# EAGLE schematic wordclock-r2-grid-routed (EAGLE 5.11)
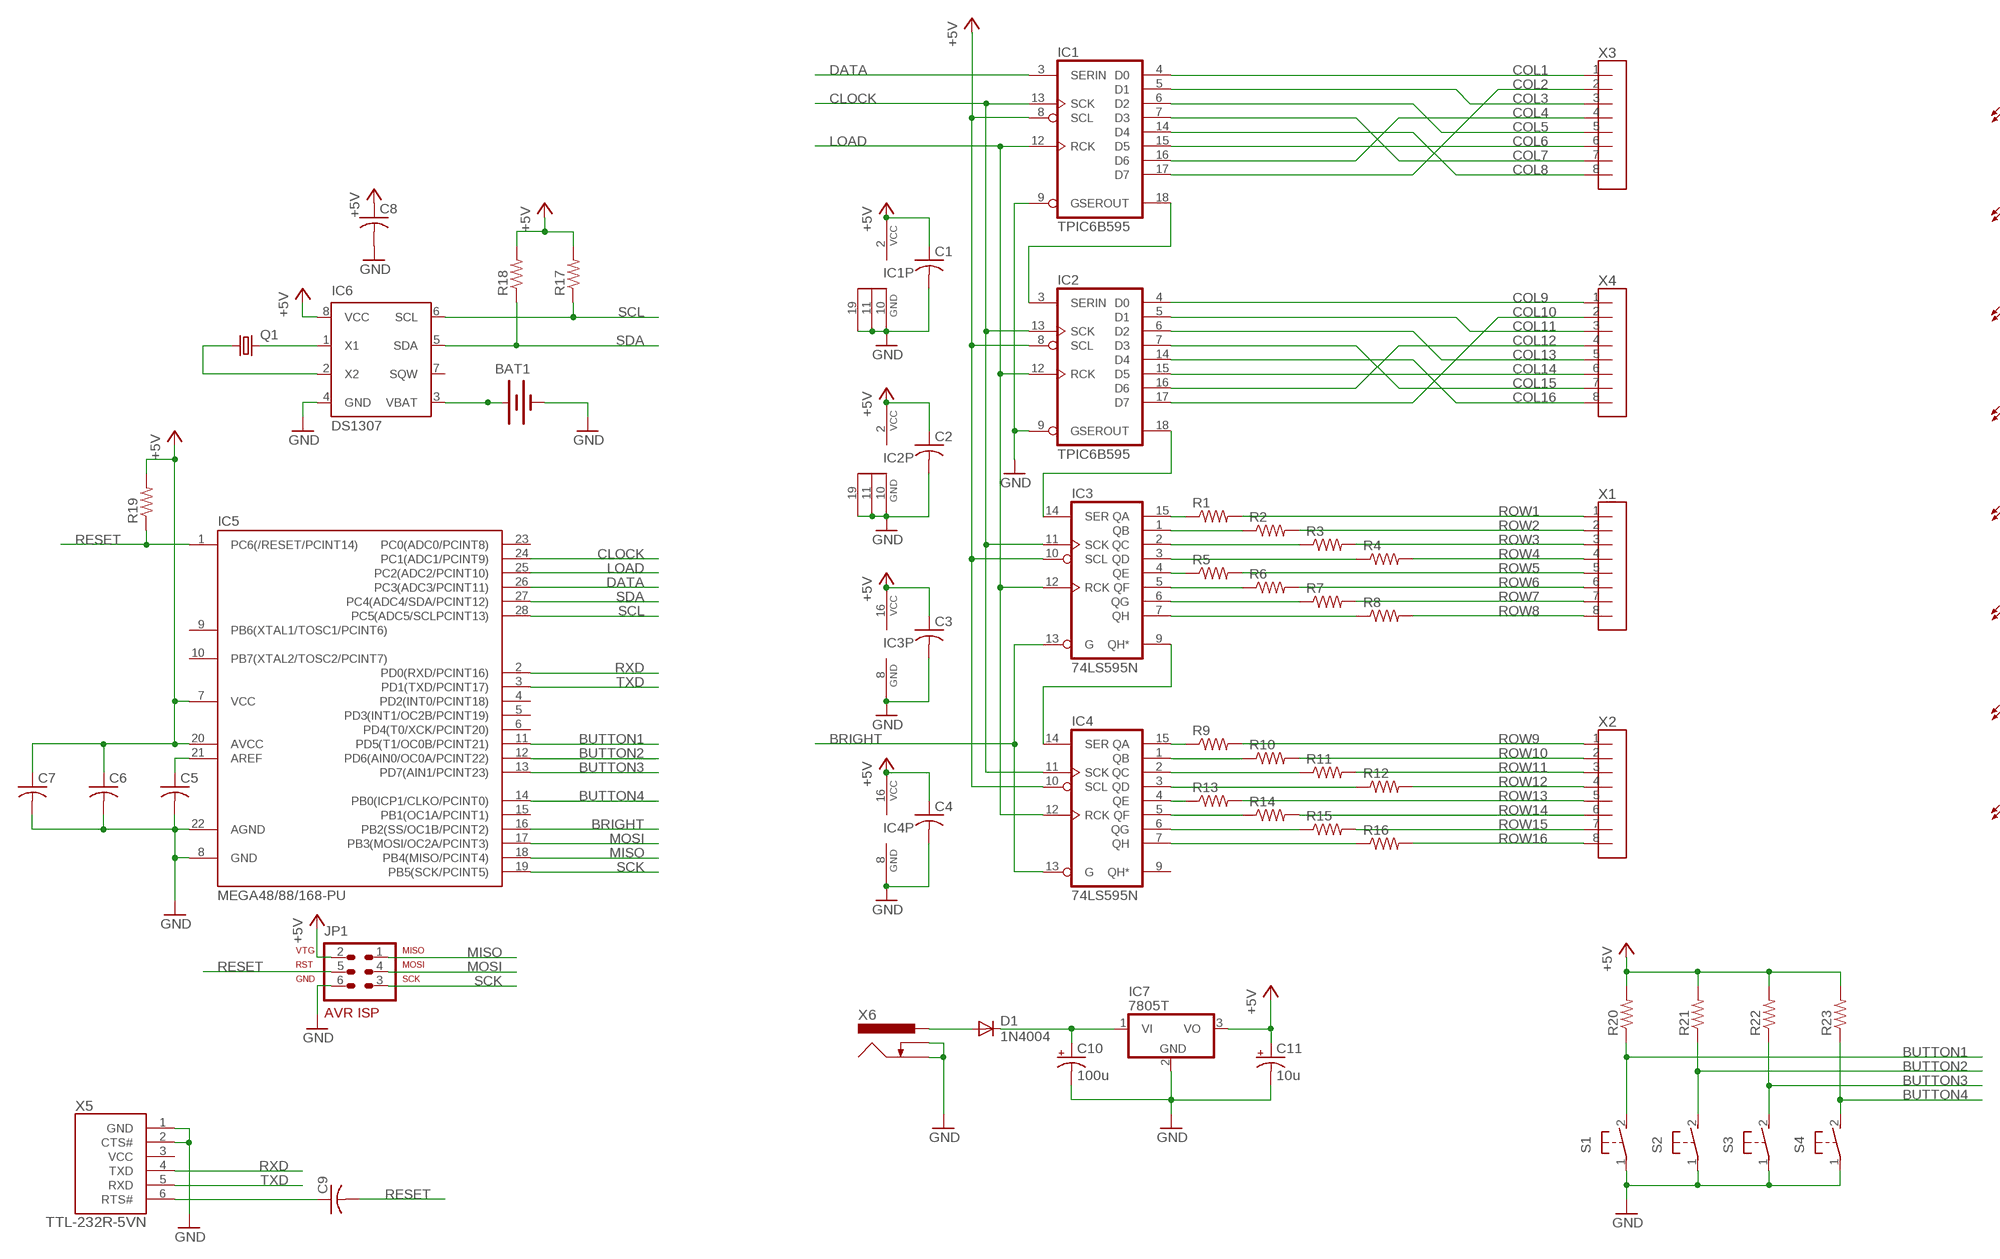
[diagram p0: schematic, sheet 1, part 1 of 2]
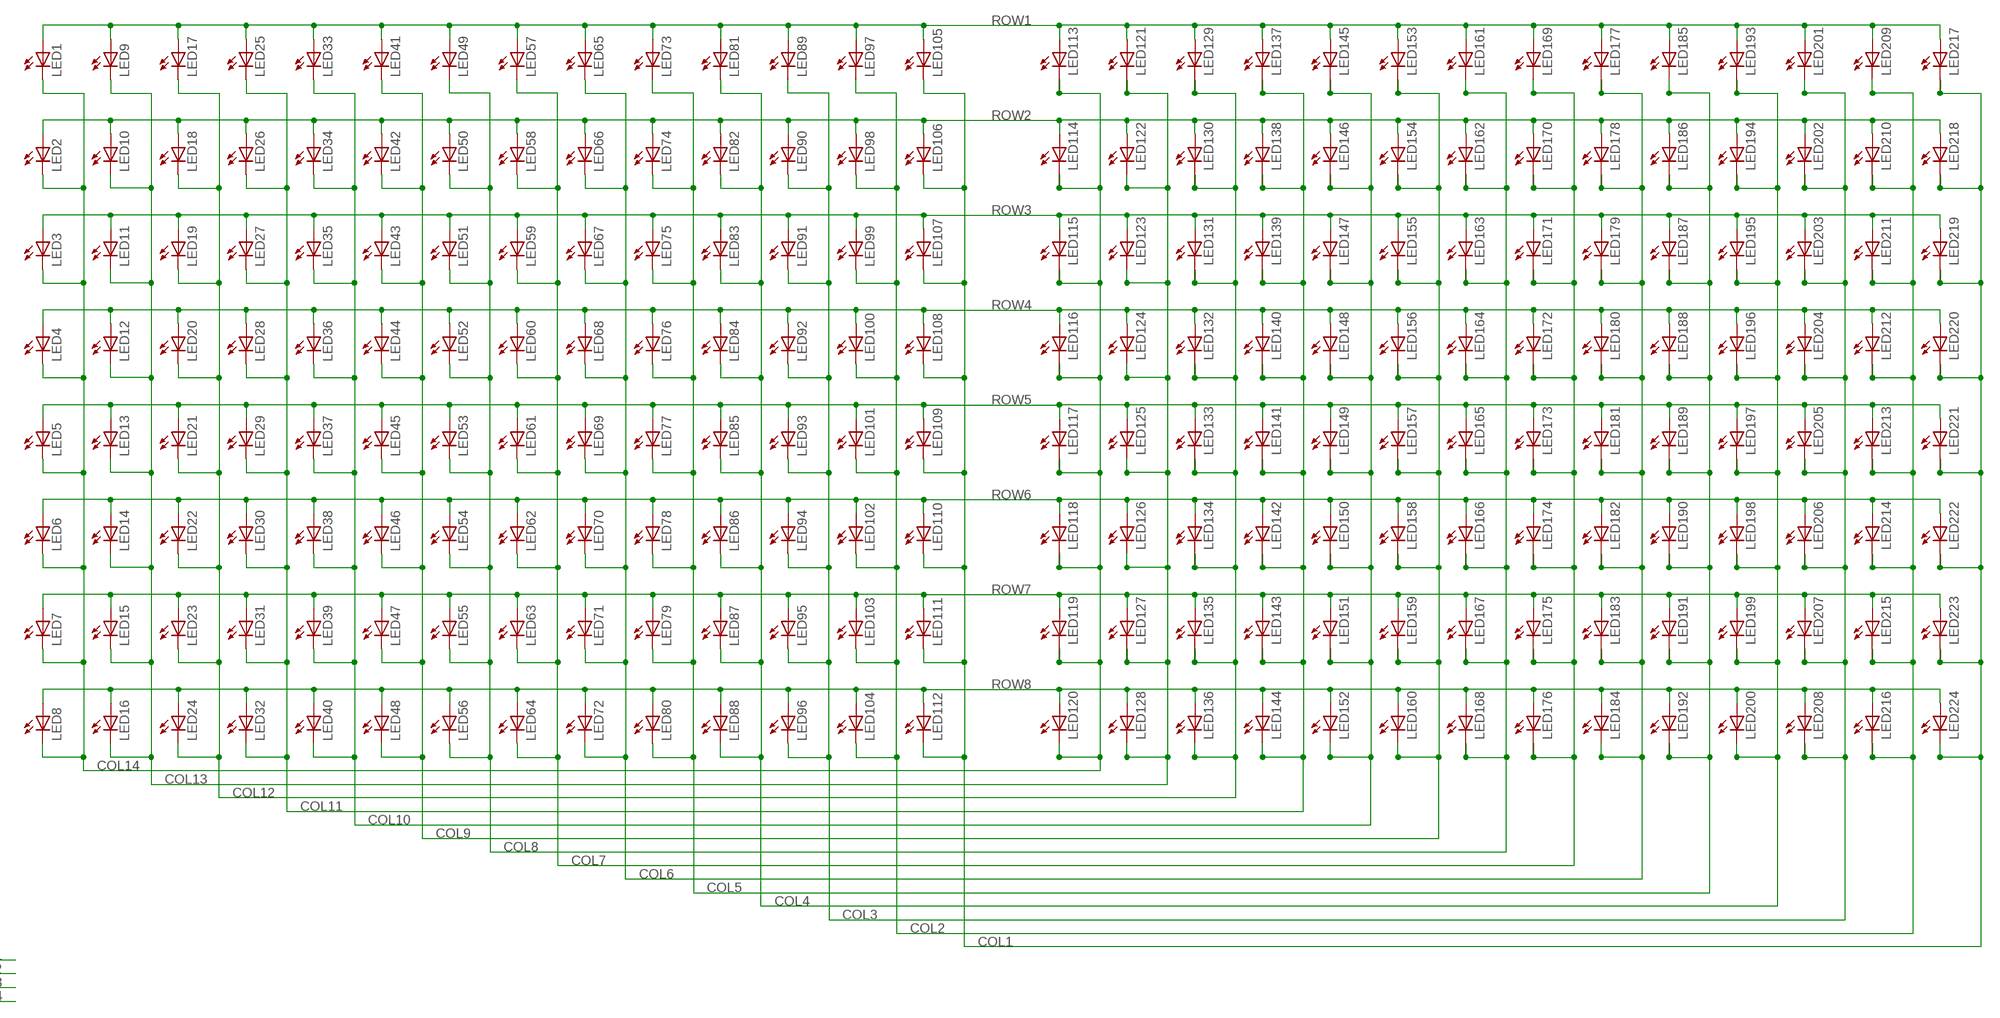
[diagram p1: schematic, sheet 1, part 2 of 2]

## Parts
BAT1  BATTERY12MM  [BATTCON_12MM]
C1  C-US050-025X075  [C050-025X075]
C2  C-US050-025X075  [C050-025X075]
C3  C-US050-025X075  [C050-025X075]
C4  C-US050-025X075  [C050-025X075]
C5  C-US050-025X075  [C050-025X075]
C6  C-US050-025X075  [C050-025X075]
C7  C-US050-025X075  [C050-025X075]
C8  C-US050-025X075  [C050-025X075]
C9  C-US050-025X075  [C050-025X075]
C10  100u  CPOL-USE3.5-8  [E3,5-8]
C11  10u  CPOL-USE2.5-6  [E2,5-6]
D1  1N4004  [DO41-10]
IC1  TPIC6B595  [DIL20]
IC2  TPIC6B595  [DIL20]
IC3  74LS595N  [DIL16]
IC4  74LS595N  [DIL16]
IC5  MEGA48/88/168-PU  [DIL28-3]
IC6  DS1307  [DIL08]
IC7  7805T  [TO220H]
JP1  AVR-ISP-6  [AVR-ISP-6]
LED1  LEDKA-3528ASYC  [KA-3528ASYC]
LED2  LEDKA-3528ASYC  [KA-3528ASYC]
LED3  LEDKA-3528ASYC  [KA-3528ASYC]
LED4  LEDKA-3528ASYC  [KA-3528ASYC]
LED5  LEDKA-3528ASYC  [KA-3528ASYC]
LED6  LEDKA-3528ASYC  [KA-3528ASYC]
LED7  LEDKA-3528ASYC  [KA-3528ASYC]
LED8  LEDKA-3528ASYC  [KA-3528ASYC]
LED9  LEDKA-3528ASYC  [KA-3528ASYC]
LED10  LEDKA-3528ASYC  [KA-3528ASYC]
LED11  LEDKA-3528ASYC  [KA-3528ASYC]
LED12  LEDKA-3528ASYC  [KA-3528ASYC]
LED13  LEDKA-3528ASYC  [KA-3528ASYC]
LED14  LEDKA-3528ASYC  [KA-3528ASYC]
LED15  LEDKA-3528ASYC  [KA-3528ASYC]
LED16  LEDKA-3528ASYC  [KA-3528ASYC]
LED17  LEDKA-3528ASYC  [KA-3528ASYC]
LED18  LEDKA-3528ASYC  [KA-3528ASYC]
LED19  LEDKA-3528ASYC  [KA-3528ASYC]
LED20  LEDKA-3528ASYC  [KA-3528ASYC]
LED21  LEDKA-3528ASYC  [KA-3528ASYC]
LED22  LEDKA-3528ASYC  [KA-3528ASYC]
LED23  LEDKA-3528ASYC  [KA-3528ASYC]
LED24  LEDKA-3528ASYC  [KA-3528ASYC]
LED25  LEDKA-3528ASYC  [KA-3528ASYC]
LED26  LEDKA-3528ASYC  [KA-3528ASYC]
LED27  LEDKA-3528ASYC  [KA-3528ASYC]
LED28  LEDKA-3528ASYC  [KA-3528ASYC]
LED29  LEDKA-3528ASYC  [KA-3528ASYC]
LED30  LEDKA-3528ASYC  [KA-3528ASYC]
LED31  LEDKA-3528ASYC  [KA-3528ASYC]
LED32  LEDKA-3528ASYC  [KA-3528ASYC]
LED33  LEDKA-3528ASYC  [KA-3528ASYC]
LED34  LEDKA-3528ASYC  [KA-3528ASYC]
LED35  LEDKA-3528ASYC  [KA-3528ASYC]
LED36  LEDKA-3528ASYC  [KA-3528ASYC]
LED37  LEDKA-3528ASYC  [KA-3528ASYC]
LED38  LEDKA-3528ASYC  [KA-3528ASYC]
LED39  LEDKA-3528ASYC  [KA-3528ASYC]
LED40  LEDKA-3528ASYC  [KA-3528ASYC]
LED41  LEDKA-3528ASYC  [KA-3528ASYC]
LED42  LEDKA-3528ASYC  [KA-3528ASYC]
LED43  LEDKA-3528ASYC  [KA-3528ASYC]
LED44  LEDKA-3528ASYC  [KA-3528ASYC]
LED45  LEDKA-3528ASYC  [KA-3528ASYC]
LED46  LEDKA-3528ASYC  [KA-3528ASYC]
LED47  LEDKA-3528ASYC  [KA-3528ASYC]
LED48  LEDKA-3528ASYC  [KA-3528ASYC]
LED49  LEDKA-3528ASYC  [KA-3528ASYC]
LED50  LEDKA-3528ASYC  [KA-3528ASYC]
LED51  LEDKA-3528ASYC  [KA-3528ASYC]
LED52  LEDKA-3528ASYC  [KA-3528ASYC]
LED53  LEDKA-3528ASYC  [KA-3528ASYC]
LED54  LEDKA-3528ASYC  [KA-3528ASYC]
LED55  LEDKA-3528ASYC  [KA-3528ASYC]
LED56  LEDKA-3528ASYC  [KA-3528ASYC]
LED57  LEDKA-3528ASYC  [KA-3528ASYC]
LED58  LEDKA-3528ASYC  [KA-3528ASYC]
LED59  LEDKA-3528ASYC  [KA-3528ASYC]
LED60  LEDKA-3528ASYC  [KA-3528ASYC]
LED61  LEDKA-3528ASYC  [KA-3528ASYC]
LED62  LEDKA-3528ASYC  [KA-3528ASYC]
LED63  LEDKA-3528ASYC  [KA-3528ASYC]
LED64  LEDKA-3528ASYC  [KA-3528ASYC]
LED65  LEDKA-3528ASYC  [KA-3528ASYC]
LED66  LEDKA-3528ASYC  [KA-3528ASYC]
LED67  LEDKA-3528ASYC  [KA-3528ASYC]
LED68  LEDKA-3528ASYC  [KA-3528ASYC]
LED69  LEDKA-3528ASYC  [KA-3528ASYC]
LED70  LEDKA-3528ASYC  [KA-3528ASYC]
LED71  LEDKA-3528ASYC  [KA-3528ASYC]
LED72  LEDKA-3528ASYC  [KA-3528ASYC]
LED73  LEDKA-3528ASYC  [KA-3528ASYC]
LED74  LEDKA-3528ASYC  [KA-3528ASYC]
LED75  LEDKA-3528ASYC  [KA-3528ASYC]
LED76  LEDKA-3528ASYC  [KA-3528ASYC]
LED77  LEDKA-3528ASYC  [KA-3528ASYC]
LED78  LEDKA-3528ASYC  [KA-3528ASYC]
LED79  LEDKA-3528ASYC  [KA-3528ASYC]
LED80  LEDKA-3528ASYC  [KA-3528ASYC]
LED81  LEDKA-3528ASYC  [KA-3528ASYC]
LED82  LEDKA-3528ASYC  [KA-3528ASYC]
LED83  LEDKA-3528ASYC  [KA-3528ASYC]
LED84  LEDKA-3528ASYC  [KA-3528ASYC]
LED85  LEDKA-3528ASYC  [KA-3528ASYC]
LED86  LEDKA-3528ASYC  [KA-3528ASYC]
LED87  LEDKA-3528ASYC  [KA-3528ASYC]
LED88  LEDKA-3528ASYC  [KA-3528ASYC]
LED89  LEDKA-3528ASYC  [KA-3528ASYC]
LED90  LEDKA-3528ASYC  [KA-3528ASYC]
LED91  LEDKA-3528ASYC  [KA-3528ASYC]
LED92  LEDKA-3528ASYC  [KA-3528ASYC]
LED93  LEDKA-3528ASYC  [KA-3528ASYC]
LED94  LEDKA-3528ASYC  [KA-3528ASYC]
LED95  LEDKA-3528ASYC  [KA-3528ASYC]
LED96  LEDKA-3528ASYC  [KA-3528ASYC]
LED97  LEDKA-3528ASYC  [KA-3528ASYC]
LED98  LEDKA-3528ASYC  [KA-3528ASYC]
LED99  LEDKA-3528ASYC  [KA-3528ASYC]
LED100  LEDKA-3528ASYC  [KA-3528ASYC]
LED101  LEDKA-3528ASYC  [KA-3528ASYC]
LED102  LEDKA-3528ASYC  [KA-3528ASYC]
LED103  LEDKA-3528ASYC  [KA-3528ASYC]
LED104  LEDKA-3528ASYC  [KA-3528ASYC]
LED105  LEDKA-3528ASYC  [KA-3528ASYC]
LED106  LEDKA-3528ASYC  [KA-3528ASYC]
LED107  LEDKA-3528ASYC  [KA-3528ASYC]
LED108  LEDKA-3528ASYC  [KA-3528ASYC]
LED109  LEDKA-3528ASYC  [KA-3528ASYC]
LED110  LEDKA-3528ASYC  [KA-3528ASYC]
LED111  LEDKA-3528ASYC  [KA-3528ASYC]
LED112  LEDKA-3528ASYC  [KA-3528ASYC]
LED113  LED-2AC-SUPERFLUX  [SUPERFLUX-7.6X7.6]
LED114  LED-2AC-SUPERFLUX  [SUPERFLUX-7.6X7.6]
LED115  LED-2AC-SUPERFLUX  [SUPERFLUX-7.6X7.6]
LED116  LED-2AC-SUPERFLUX  [SUPERFLUX-7.6X7.6]
LED117  LED-2AC-SUPERFLUX  [SUPERFLUX-7.6X7.6]
LED118  LED-2AC-SUPERFLUX  [SUPERFLUX-7.6X7.6]
LED119  LED-2AC-SUPERFLUX  [SUPERFLUX-7.6X7.6]
LED120  LED-2AC-SUPERFLUX  [SUPERFLUX-7.6X7.6]
LED121  LED-2AC-SUPERFLUX  [SUPERFLUX-7.6X7.6]
LED122  LED-2AC-SUPERFLUX  [SUPERFLUX-7.6X7.6]
LED123  LED-2AC-SUPERFLUX  [SUPERFLUX-7.6X7.6]
LED124  LED-2AC-SUPERFLUX  [SUPERFLUX-7.6X7.6]
LED125  LED-2AC-SUPERFLUX  [SUPERFLUX-7.6X7.6]
LED126  LED-2AC-SUPERFLUX  [SUPERFLUX-7.6X7.6]
LED127  LED-2AC-SUPERFLUX  [SUPERFLUX-7.6X7.6]
LED128  LED-2AC-SUPERFLUX  [SUPERFLUX-7.6X7.6]
LED129  LED-2AC-SUPERFLUX  [SUPERFLUX-7.6X7.6]
LED130  LED-2AC-SUPERFLUX  [SUPERFLUX-7.6X7.6]
LED131  LED-2AC-SUPERFLUX  [SUPERFLUX-7.6X7.6]
LED132  LED-2AC-SUPERFLUX  [SUPERFLUX-7.6X7.6]
LED133  LED-2AC-SUPERFLUX  [SUPERFLUX-7.6X7.6]
LED134  LED-2AC-SUPERFLUX  [SUPERFLUX-7.6X7.6]
LED135  LED-2AC-SUPERFLUX  [SUPERFLUX-7.6X7.6]
LED136  LED-2AC-SUPERFLUX  [SUPERFLUX-7.6X7.6]
LED137  LED-2AC-SUPERFLUX  [SUPERFLUX-7.6X7.6]
LED138  LED-2AC-SUPERFLUX  [SUPERFLUX-7.6X7.6]
LED139  LED-2AC-SUPERFLUX  [SUPERFLUX-7.6X7.6]
LED140  LED-2AC-SUPERFLUX  [SUPERFLUX-7.6X7.6]
LED141  LED-2AC-SUPERFLUX  [SUPERFLUX-7.6X7.6]
LED142  LED-2AC-SUPERFLUX  [SUPERFLUX-7.6X7.6]
LED143  LED-2AC-SUPERFLUX  [SUPERFLUX-7.6X7.6]
LED144  LED-2AC-SUPERFLUX  [SUPERFLUX-7.6X7.6]
LED145  LED-2AC-SUPERFLUX  [SUPERFLUX-7.6X7.6]
LED146  LED-2AC-SUPERFLUX  [SUPERFLUX-7.6X7.6]
LED147  LED-2AC-SUPERFLUX  [SUPERFLUX-7.6X7.6]
LED148  LED-2AC-SUPERFLUX  [SUPERFLUX-7.6X7.6]
LED149  LED-2AC-SUPERFLUX  [SUPERFLUX-7.6X7.6]
LED150  LED-2AC-SUPERFLUX  [SUPERFLUX-7.6X7.6]
LED151  LED-2AC-SUPERFLUX  [SUPERFLUX-7.6X7.6]
LED152  LED-2AC-SUPERFLUX  [SUPERFLUX-7.6X7.6]
LED153  LED-2AC-SUPERFLUX  [SUPERFLUX-7.6X7.6]
LED154  LED-2AC-SUPERFLUX  [SUPERFLUX-7.6X7.6]
LED155  LED-2AC-SUPERFLUX  [SUPERFLUX-7.6X7.6]
LED156  LED-2AC-SUPERFLUX  [SUPERFLUX-7.6X7.6]
LED157  LED-2AC-SUPERFLUX  [SUPERFLUX-7.6X7.6]
LED158  LED-2AC-SUPERFLUX  [SUPERFLUX-7.6X7.6]
LED159  LED-2AC-SUPERFLUX  [SUPERFLUX-7.6X7.6]
LED160  LED-2AC-SUPERFLUX  [SUPERFLUX-7.6X7.6]
LED161  LED-2AC-SUPERFLUX  [SUPERFLUX-7.6X7.6]
LED162  LED-2AC-SUPERFLUX  [SUPERFLUX-7.6X7.6]
LED163  LED-2AC-SUPERFLUX  [SUPERFLUX-7.6X7.6]
LED164  LED-2AC-SUPERFLUX  [SUPERFLUX-7.6X7.6]
LED165  LED-2AC-SUPERFLUX  [SUPERFLUX-7.6X7.6]
LED166  LED-2AC-SUPERFLUX  [SUPERFLUX-7.6X7.6]
LED167  LED-2AC-SUPERFLUX  [SUPERFLUX-7.6X7.6]
LED168  LED-2AC-SUPERFLUX  [SUPERFLUX-7.6X7.6]
LED169  LED-2AC-SUPERFLUX  [SUPERFLUX-7.6X7.6]
LED170  LED-2AC-SUPERFLUX  [SUPERFLUX-7.6X7.6]
LED171  LED-2AC-SUPERFLUX  [SUPERFLUX-7.6X7.6]
LED172  LED-2AC-SUPERFLUX  [SUPERFLUX-7.6X7.6]
LED173  LED-2AC-SUPERFLUX  [SUPERFLUX-7.6X7.6]
LED174  LED-2AC-SUPERFLUX  [SUPERFLUX-7.6X7.6]
LED175  LED-2AC-SUPERFLUX  [SUPERFLUX-7.6X7.6]
LED176  LED-2AC-SUPERFLUX  [SUPERFLUX-7.6X7.6]
LED177  LED-2AC-SUPERFLUX  [SUPERFLUX-7.6X7.6]
LED178  LED-2AC-SUPERFLUX  [SUPERFLUX-7.6X7.6]
LED179  LED-2AC-SUPERFLUX  [SUPERFLUX-7.6X7.6]
LED180  LED-2AC-SUPERFLUX  [SUPERFLUX-7.6X7.6]
LED181  LED-2AC-SUPERFLUX  [SUPERFLUX-7.6X7.6]
LED182  LED-2AC-SUPERFLUX  [SUPERFLUX-7.6X7.6]
LED183  LED-2AC-SUPERFLUX  [SUPERFLUX-7.6X7.6]
LED184  LED-2AC-SUPERFLUX  [SUPERFLUX-7.6X7.6]
LED185  LED-2AC-SUPERFLUX  [SUPERFLUX-7.6X7.6]
LED186  LED-2AC-SUPERFLUX  [SUPERFLUX-7.6X7.6]
LED187  LED-2AC-SUPERFLUX  [SUPERFLUX-7.6X7.6]
LED188  LED-2AC-SUPERFLUX  [SUPERFLUX-7.6X7.6]
LED189  LED-2AC-SUPERFLUX  [SUPERFLUX-7.6X7.6]
LED190  LED-2AC-SUPERFLUX  [SUPERFLUX-7.6X7.6]
LED191  LED-2AC-SUPERFLUX  [SUPERFLUX-7.6X7.6]
LED192  LED-2AC-SUPERFLUX  [SUPERFLUX-7.6X7.6]
LED193  LED-2AC-SUPERFLUX  [SUPERFLUX-7.6X7.6]
LED194  LED-2AC-SUPERFLUX  [SUPERFLUX-7.6X7.6]
LED195  LED-2AC-SUPERFLUX  [SUPERFLUX-7.6X7.6]
LED196  LED-2AC-SUPERFLUX  [SUPERFLUX-7.6X7.6]
LED197  LED-2AC-SUPERFLUX  [SUPERFLUX-7.6X7.6]
LED198  LED-2AC-SUPERFLUX  [SUPERFLUX-7.6X7.6]
LED199  LED-2AC-SUPERFLUX  [SUPERFLUX-7.6X7.6]
LED200  LED-2AC-SUPERFLUX  [SUPERFLUX-7.6X7.6]
LED201  LED-2AC-SUPERFLUX  [SUPERFLUX-7.6X7.6]
LED202  LED-2AC-SUPERFLUX  [SUPERFLUX-7.6X7.6]
LED203  LED-2AC-SUPERFLUX  [SUPERFLUX-7.6X7.6]
LED204  LED-2AC-SUPERFLUX  [SUPERFLUX-7.6X7.6]
LED205  LED-2AC-SUPERFLUX  [SUPERFLUX-7.6X7.6]
LED206  LED-2AC-SUPERFLUX  [SUPERFLUX-7.6X7.6]
LED207  LED-2AC-SUPERFLUX  [SUPERFLUX-7.6X7.6]
LED208  LED-2AC-SUPERFLUX  [SUPERFLUX-7.6X7.6]
LED209  LED-2AC-SUPERFLUX  [SUPERFLUX-7.6X7.6]
LED210  LED-2AC-SUPERFLUX  [SUPERFLUX-7.6X7.6]
LED211  LED-2AC-SUPERFLUX  [SUPERFLUX-7.6X7.6]
LED212  LED-2AC-SUPERFLUX  [SUPERFLUX-7.6X7.6]
LED213  LED-2AC-SUPERFLUX  [SUPERFLUX-7.6X7.6]
LED214  LED-2AC-SUPERFLUX  [SUPERFLUX-7.6X7.6]
LED215  LED-2AC-SUPERFLUX  [SUPERFLUX-7.6X7.6]
LED216  LED-2AC-SUPERFLUX  [SUPERFLUX-7.6X7.6]
LED217  LED-2AC-SUPERFLUX  [SUPERFLUX-7.6X7.6]
LED218  LED-2AC-SUPERFLUX  [SUPERFLUX-7.6X7.6]
LED219  LED-2AC-SUPERFLUX  [SUPERFLUX-7.6X7.6]
LED220  LED-2AC-SUPERFLUX  [SUPERFLUX-7.6X7.6]
LED221  LED-2AC-SUPERFLUX  [SUPERFLUX-7.6X7.6]
LED222  LED-2AC-SUPERFLUX  [SUPERFLUX-7.6X7.6]
LED223  LED-2AC-SUPERFLUX  [SUPERFLUX-7.6X7.6]
LED224  LED-2AC-SUPERFLUX  [SUPERFLUX-7.6X7.6]
Q1  CRYSTALTC38H  [TC38H]
R1  R-US_0207/2V  [0207/2V]
R2  R-US_0207/2V  [0207/2V]
R3  R-US_0207/2V  [0207/2V]
R4  R-US_0207/2V  [0207/2V]
R5  R-US_0207/2V  [0207/2V]
R6  R-US_0207/2V  [0207/2V]
R7  R-US_0207/2V  [0207/2V]
R8  R-US_0207/2V  [0207/2V]
R9  R-US_0207/2V  [0207/2V]
R10  R-US_0207/2V  [0207/2V]
R11  R-US_0207/2V  [0207/2V]
R12  R-US_0207/2V  [0207/2V]
R13  R-US_0207/2V  [0207/2V]
R14  R-US_0207/2V  [0207/2V]
R15  R-US_0207/2V  [0207/2V]
R16  R-US_0207/2V  [0207/2V]
R17  R-US_0207/10  [0207/10]
R18  R-US_0207/10  [0207/10]
R19  R-US_0207/10  [0207/10]
R20  R-US_0207/10  [0207/10]
R21  R-US_0207/10  [0207/10]
R22  R-US_0207/10  [0207/10]
R23  R-US_0207/10  [0207/10]
S1  31-XX  [B3F-31XX]
S2  31-XX  [B3F-31XX]
S3  31-XX  [B3F-31XX]
S4  31-XX  [B3F-31XX]
X1  M08-100MIL  [100MIL-8]
X2  M08-100MIL  [100MIL-8]
X3  M08-100MIL  [100MIL-8]
X4  M08-100MIL  [100MIL-8]
X5  TTL-232R-5VN  [USBCABLE-0.100-NOLBL]
X6  PJ-002B  [PJ-002]

## Nets
+5V: C1.1 C2.1 C3.1 C4.1 C6.1 C7.1 C8.1 C11.+ IC1.2(VCC) IC1.8(SCL) IC2.2(VCC) IC2.8(SCL) IC3.10(SCL) IC3.16(VCC) IC4.10(SCL) IC4.16(VCC) IC5.7(VCC) IC5.20(AVCC) IC6.8(VCC) IC7.3(VO) JP1.2 R17.2 R18.2 R19.2 R20.2 R21.2 R22.2 R23.2
BRIGHT: IC3.13(G) IC4.13(G) IC5.16(PB2(SS/OC1B/PCINT2))
BUTTON1: IC5.11(PD5(T1/OC0B/PCINT21)) R20.1 S1.2(S)
BUTTON2: IC5.12(PD6(AIN0/OC0A/PCINT22)) R21.1 S2.2(S)
BUTTON3: IC5.13(PD7(AIN1/PCINT23)) R22.1 S3.2(S)
BUTTON4: IC5.14(PB0(ICP1/CLKO/PCINT0)) R23.1 S4.2(S)
CLOCK: IC1.13(SCK) IC2.13(SCK) IC3.11(SCK) IC4.11(SCK) IC5.24(PC1(ADC1/PCINT9))
COL1: IC1.4(D0) LED105.C LED106.C LED107.C LED108.C LED109.C LED110.C LED111.C LED112.C LED217.1(C) LED217.3(C) LED218.1(C) LED218.3(C) LED219.1(C) LED219.3(C) LED220.1(C) LED220.3(C) LED221.1(C) LED221.3(C) LED222.1(C) LED222.3(C) LED223.1(C) LED223.3(C) LED224.1(C) LED224.3(C) X3.1
COL2: IC1.17(D7) LED97.C LED98.C LED99.C LED100.C LED101.C LED102.C LED103.C LED104.C LED209.1(C) LED209.3(C) LED210.1(C) LED210.3(C) LED211.1(C) LED211.3(C) LED212.1(C) LED212.3(C) LED213.1(C) LED213.3(C) LED214.1(C) LED214.3(C) LED215.1(C) LED215.3(C) LED216.1(C) LED216.3(C) X3.2
COL3: IC1.5(D1) LED89.C LED90.C LED91.C LED92.C LED93.C LED94.C LED95.C LED96.C LED201.1(C) LED201.3(C) LED202.1(C) LED202.3(C) LED203.1(C) LED203.3(C) LED204.1(C) LED204.3(C) LED205.1(C) LED205.3(C) LED206.1(C) LED206.3(C) LED207.1(C) LED207.3(C) LED208.1(C) LED208.3(C) X3.3
COL4: IC1.16(D6) LED81.C LED82.C LED83.C LED84.C LED85.C LED86.C LED87.C LED88.C LED193.1(C) LED193.3(C) LED194.1(C) LED194.3(C) LED195.1(C) LED195.3(C) LED196.1(C) LED196.3(C) LED197.1(C) LED197.3(C) LED198.1(C) LED198.3(C) LED199.1(C) LED199.3(C) LED200.1(C) LED200.3(C) X3.4
COL5: IC1.6(D2) LED73.C LED74.C LED75.C LED76.C LED77.C LED78.C LED79.C LED80.C LED185.1(C) LED185.3(C) LED186.1(C) LED186.3(C) LED187.1(C) LED187.3(C) LED188.1(C) LED188.3(C) LED189.1(C) LED189.3(C) LED190.1(C) LED190.3(C) LED191.1(C) LED191.3(C) LED192.1(C) LED192.3(C) X3.5
COL6: IC1.15(D5) LED65.C LED66.C LED67.C LED68.C LED69.C LED70.C LED71.C LED72.C LED177.1(C) LED177.3(C) LED178.1(C) LED178.3(C) LED179.1(C) LED179.3(C) LED180.1(C) LED180.3(C) LED181.1(C) LED181.3(C) LED182.1(C) LED182.3(C) LED183.1(C) LED183.3(C) LED184.1(C) LED184.3(C) X3.6
COL7: IC1.7(D3) LED57.C LED58.C LED59.C LED60.C LED61.C LED62.C LED63.C LED64.C LED169.1(C) LED169.3(C) LED170.1(C) LED170.3(C) LED171.1(C) LED171.3(C) LED172.1(C) LED172.3(C) LED173.1(C) LED173.3(C) LED174.1(C) LED174.3(C) LED175.1(C) LED175.3(C) LED176.1(C) LED176.3(C) X3.7
COL8: IC1.14(D4) LED49.C LED50.C LED51.C LED52.C LED53.C LED54.C LED55.C LED56.C LED161.1(C) LED161.3(C) LED162.1(C) LED162.3(C) LED163.1(C) LED163.3(C) LED164.1(C) LED164.3(C) LED165.1(C) LED165.3(C) LED166.1(C) LED166.3(C) LED167.1(C) LED167.3(C) LED168.1(C) LED168.3(C) X3.8
COL9: IC2.4(D0) LED41.C LED42.C LED43.C LED44.C LED45.C LED46.C LED47.C LED48.C LED153.1(C) LED153.3(C) LED154.1(C) LED154.3(C) LED155.1(C) LED155.3(C) LED156.1(C) LED156.3(C) LED157.1(C) LED157.3(C) LED158.1(C) LED158.3(C) LED159.1(C) LED159.3(C) LED160.1(C) LED160.3(C) X4.1
COL10: IC2.17(D7) LED33.C LED34.C LED35.C LED36.C LED37.C LED38.C LED39.C LED40.C LED145.1(C) LED145.3(C) LED146.1(C) LED146.3(C) LED147.1(C) LED147.3(C) LED148.1(C) LED148.3(C) LED149.1(C) LED149.3(C) LED150.1(C) LED150.3(C) LED151.1(C) LED151.3(C) LED152.1(C) LED152.3(C) X4.2
COL11: IC2.5(D1) LED25.C LED26.C LED27.C LED28.C LED29.C LED30.C LED31.C LED32.C LED137.1(C) LED137.3(C) LED138.1(C) LED138.3(C) LED139.1(C) LED139.3(C) LED140.1(C) LED140.3(C) LED141.1(C) LED141.3(C) LED142.1(C) LED142.3(C) LED143.1(C) LED143.3(C) LED144.1(C) LED144.3(C) X4.3
COL12: IC2.16(D6) LED17.C LED18.C LED19.C LED20.C LED21.C LED22.C LED23.C LED24.C LED129.1(C) LED129.3(C) LED130.1(C) LED130.3(C) LED131.1(C) LED131.3(C) LED132.1(C) LED132.3(C) LED133.1(C) LED133.3(C) LED134.1(C) LED134.3(C) LED135.1(C) LED135.3(C) LED136.1(C) LED136.3(C) X4.4
COL13: IC2.6(D2) LED9.C LED10.C LED11.C LED12.C LED13.C LED14.C LED15.C LED16.C LED121.1(C) LED121.3(C) LED122.1(C) LED122.3(C) LED123.1(C) LED123.3(C) LED124.1(C) LED124.3(C) LED125.1(C) LED125.3(C) LED126.1(C) LED126.3(C) LED127.1(C) LED127.3(C) LED128.1(C) LED128.3(C) X4.5
COL14: IC2.15(D5) LED1.C LED2.C LED3.C LED4.C LED5.C LED6.C LED7.C LED8.C LED113.1(C) LED113.3(C) LED114.1(C) LED114.3(C) LED115.1(C) LED115.3(C) LED116.1(C) LED116.3(C) LED117.1(C) LED117.3(C) LED118.1(C) LED118.3(C) LED119.1(C) LED119.3(C) LED120.1(C) LED120.3(C) X4.6
COL15: IC2.7(D3) X4.7
COL16: IC2.14(D4) X4.8
DATA: IC1.3(SERIN) IC5.26(PC3(ADC3/PCINT11))
GND: BAT1.GND(-) C1.2 C2.2 C3.2 C4.2 C5.2 C6.2 C7.2 C8.2 C10.- C11.- IC1.9(G) IC1.10(GND) IC1.11(GND1) IC1.19(GND2) IC2.9(G) IC2.10(GND) IC2.11(GND1) IC2.19(GND2) IC3.8(GND) IC4.8(GND) IC5.8(GND) IC5.22(AGND) IC6.4(GND) IC7.2(GND) JP1.6 S1.1(P) S2.1(P) S3.1(P) S4.1(P) X5.1(GND) X5.2(CTS#) X6.2 X6.3
LOAD: IC1.12(RCK) IC2.12(RCK) IC3.12(RCK) IC4.12(RCK) IC5.25(PC2(ADC2/PCINT10))
MISO: IC5.18(PB4(MISO/PCINT4)) JP1.1
MOSI: IC5.17(PB3(MOSI/OC2A/PCINT3)) JP1.4
N$4: IC1.18(SEROUT) IC2.3(SERIN)
N$5: IC2.18(SEROUT) IC3.14(SER)
N$6: IC3.9(QH*) IC4.14(SER)
N$7: IC3.15(QA) R1.1
N$8: IC3.1(QB) R2.1
N$9: IC3.2(QC) R3.1
N$10: IC3.3(QD) R4.1
N$11: IC3.4(QE) R5.1
N$12: IC3.5(QF) R6.1
N$13: IC3.6(QG) R7.1
N$14: IC3.7(QH) R8.1
N$15: C9.1 X5.6(RTS#)
N$16: IC4.15(QA) R9.1
N$17: IC4.1(QB) R10.1
N$18: IC4.2(QC) R11.1
N$19: IC4.3(QD) R12.1
N$20: IC4.4(QE) R13.1
N$21: IC4.5(QF) R14.1
N$22: IC4.6(QG) R15.1
N$23: IC4.7(QH) R16.1
N$37: IC6.2(X2) Q1.1
N$54: C5.1 IC5.21(AREF)
N$55: IC6.1(X1) Q1.2
N$56: D1.A X6.1
N$57: C10.+ D1.C IC7.1(VI)
N$58: BAT1.PWR@1(+) IC6.3(VBAT)
RESET: C9.2 IC5.1(PC6(/RESET/PCINT14)) JP1.5 R19.1
ROW1: LED1.A LED9.A LED17.A LED25.A LED33.A LED41.A LED49.A LED57.A LED65.A LED73.A LED81.A LED89.A LED97.A LED105.A LED113.2(A) LED121.2(A) LED129.2(A) LED137.2(A) LED145.2(A) LED153.2(A) LED161.2(A) LED169.2(A) LED177.2(A) LED185.2(A) LED193.2(A) LED201.2(A) LED209.2(A) LED217.2(A) R1.2 X1.1
ROW2: LED2.A LED10.A LED18.A LED26.A LED34.A LED42.A LED50.A LED58.A LED66.A LED74.A LED82.A LED90.A LED98.A LED106.A LED114.2(A) LED122.2(A) LED130.2(A) LED138.2(A) LED146.2(A) LED154.2(A) LED162.2(A) LED170.2(A) LED178.2(A) LED186.2(A) LED194.2(A) LED202.2(A) LED210.2(A) LED218.2(A) R2.2 X1.2
ROW3: LED3.A LED11.A LED19.A LED27.A LED35.A LED43.A LED51.A LED59.A LED67.A LED75.A LED83.A LED91.A LED99.A LED107.A LED115.2(A) LED123.2(A) LED131.2(A) LED139.2(A) LED147.2(A) LED155.2(A) LED163.2(A) LED171.2(A) LED179.2(A) LED187.2(A) LED195.2(A) LED203.2(A) LED211.2(A) LED219.2(A) R3.2 X1.3
ROW4: LED4.A LED12.A LED20.A LED28.A LED36.A LED44.A LED52.A LED60.A LED68.A LED76.A LED84.A LED92.A LED100.A LED108.A LED116.2(A) LED124.2(A) LED132.2(A) LED140.2(A) LED148.2(A) LED156.2(A) LED164.2(A) LED172.2(A) LED180.2(A) LED188.2(A) LED196.2(A) LED204.2(A) LED212.2(A) LED220.2(A) R4.2 X1.4
ROW5: LED5.A LED13.A LED21.A LED29.A LED37.A LED45.A LED53.A LED61.A LED69.A LED77.A LED85.A LED93.A LED101.A LED109.A LED117.2(A) LED125.2(A) LED133.2(A) LED141.2(A) LED149.2(A) LED157.2(A) LED165.2(A) LED173.2(A) LED181.2(A) LED189.2(A) LED197.2(A) LED205.2(A) LED213.2(A) LED221.2(A) R5.2 X1.5
ROW6: LED6.A LED14.A LED22.A LED30.A LED38.A LED46.A LED54.A LED62.A LED70.A LED78.A LED86.A LED94.A LED102.A LED110.A LED118.2(A) LED126.2(A) LED134.2(A) LED142.2(A) LED150.2(A) LED158.2(A) LED166.2(A) LED174.2(A) LED182.2(A) LED190.2(A) LED198.2(A) LED206.2(A) LED214.2(A) LED222.2(A) R6.2 X1.6
ROW7: LED7.A LED15.A LED23.A LED31.A LED39.A LED47.A LED55.A LED63.A LED71.A LED79.A LED87.A LED95.A LED103.A LED111.A LED119.2(A) LED127.2(A) LED135.2(A) LED143.2(A) LED151.2(A) LED159.2(A) LED167.2(A) LED175.2(A) LED183.2(A) LED191.2(A) LED199.2(A) LED207.2(A) LED215.2(A) LED223.2(A) R7.2 X1.7
ROW8: LED8.A LED16.A LED24.A LED32.A LED40.A LED48.A LED56.A LED64.A LED72.A LED80.A LED88.A LED96.A LED104.A LED112.A LED120.2(A) LED128.2(A) LED136.2(A) LED144.2(A) LED152.2(A) LED160.2(A) LED168.2(A) LED176.2(A) LED184.2(A) LED192.2(A) LED200.2(A) LED208.2(A) LED216.2(A) LED224.2(A) R8.2 X1.8
ROW9: R9.2 X2.1
ROW10: R10.2 X2.2
ROW11: R11.2 X2.3
ROW12: R12.2 X2.4
ROW13: R13.2 X2.5
ROW14: R14.2 X2.6
ROW15: R15.2 X2.7
ROW16: R16.2 X2.8
RXD: IC5.2(PD0(RXD/PCINT16)) X5.4(TXD)
SCK: IC5.19(PB5(SCK/PCINT5)) JP1.3
SCL: IC5.28(PC5(ADC5/SCLPCINT13)) IC6.6(SCL) R17.1
SDA: IC5.27(PC4(ADC4/SDA/PCINT12)) IC6.5(SDA) R18.1
TXD: IC5.3(PD1(TXD/PCINT17)) X5.5(RXD)
Unconnected: IC4.9(QH*) IC5.4(PD2(INT0/PCINT18)) IC5.5(PD3(INT1/OC2B/PCINT19)) IC5.6(PD4(T0/XCK/PCINT20)) IC5.9(PB6(XTAL1/TOSC1/PCINT6)) IC5.10(PB7(XTAL2/TOSC2/PCINT7)) IC5.15(PB1(OC1A/PCINT1)) IC5.23(PC0(ADC0/PCINT8)) IC6.7(SQW) LED113.4(A) LED114.4(A) LED115.4(A) LED116.4(A) LED117.4(A) LED118.4(A) LED119.4(A) LED120.4(A) LED121.4(A) LED122.4(A) LED123.4(A) LED124.4(A) LED125.4(A) LED126.4(A) LED127.4(A) LED128.4(A) LED129.4(A) LED130.4(A) LED131.4(A) LED132.4(A) LED133.4(A) LED134.4(A) LED135.4(A) LED136.4(A) LED137.4(A) LED138.4(A) LED139.4(A) LED140.4(A) LED141.4(A) LED142.4(A) LED143.4(A) LED144.4(A) LED145.4(A) LED146.4(A) LED147.4(A) LED148.4(A) LED149.4(A) LED150.4(A) LED151.4(A) LED152.4(A) LED153.4(A) LED154.4(A) LED155.4(A) LED156.4(A) LED157.4(A) LED158.4(A) LED159.4(A) LED160.4(A) LED161.4(A) LED162.4(A) LED163.4(A) LED164.4(A) LED165.4(A) LED166.4(A) LED167.4(A) LED168.4(A) LED169.4(A) LED170.4(A) LED171.4(A) LED172.4(A) LED173.4(A) LED174.4(A) LED175.4(A) LED176.4(A) LED177.4(A) LED178.4(A) LED179.4(A) LED180.4(A) LED181.4(A) LED182.4(A) LED183.4(A) LED184.4(A) LED185.4(A) LED186.4(A) LED187.4(A) LED188.4(A) LED189.4(A) LED190.4(A) LED191.4(A) LED192.4(A) LED193.4(A) LED194.4(A) LED195.4(A) LED196.4(A) LED197.4(A) LED198.4(A) LED199.4(A) LED200.4(A) LED201.4(A) LED202.4(A) LED203.4(A) LED204.4(A) LED205.4(A) LED206.4(A) LED207.4(A) LED208.4(A) LED209.4(A) LED210.4(A) LED211.4(A) LED212.4(A) LED213.4(A) LED214.4(A) LED215.4(A) LED216.4(A) LED217.4(A) LED218.4(A) LED219.4(A) LED220.4(A) LED221.4(A) LED222.4(A) LED223.4(A) LED224.4(A) X5.3(VCC)

## Library data of the parts
BAT1 = sfe-sparkfun:BATTERY: Battery Holders Various common sizes : AA, AAA, 20mm coin cell and 12mm coin cell.
C1-C9 = rcl:C-US: CAPACITOR, American symbol
C10 C11 = rcl:CPOL-US: POLARIZED CAPACITOR, American symbol
D1 = diode:1N4004: DIODE general purpose rectifier, 1 A
IC1 IC2 = rbg-ti-powerlogic:TPIC6B595: 8-bit SHIFT REGISTER, output latch, open collector
IC3 IC4 = 74xx-us:74*595: 8-bit SHIFT REGISTER, output latch
IC5 = avr-5-4.16:MEGA48/88/168-PU
IC6 = ds1307_pcf8583:DS1307: I2C-Bus CLOCK/CALENDAR
IC7 = linear:78*: Positive VOLTAGE REGULATOR Source: http://cache.national.com/ds/LM/LM78L05.pdf http://www.fairchildsemi.com/ds/LM/LM7805.pdf
JP1 = avr-5-4.16:AVR-ISP-6: AVR ISP-6 Serial Programming Header
LED1-LED112 = led:LED: LED OSRAM: - CHIPLED LG R971, LG N971, LY N971, LG Q971, LY Q971, LO R971, LY R971 LH N974, LH R974 LS Q976, LO Q976, LY Q976 LO Q996 - Hyper CHIPLED LW Q18S LB Q993, LB Q99A, LB R99A - SideLED LS A670, LO A670, LY A670, LG A670, LP A670 LB A673, LV A673, LT A673, LW A673 LH A674 LY A675 LS A676, LA A676, LO A676, LY A676, LW A676 LS A679, LY A679, LG A679 - Hyper Micro SIDELED® LS Y876, LA Y876, LO Y876, LY Y876 LT Y87S - SmartLED LW L88C, LW L88S LB L89C, LB L89S, LG L890 LS L89K, LO L89K, LY L89K LS L896, LA L896, LO L896, LY L896 - TOPLED LS T670, LO T670, LY T670, LG T670, LP T670 LSG T670, LSP T670, LSY T670, LOP T670, LYG T670 LG T671, LOG T671, LSG T671 LB T673, LV T673, LT T673, LW T673 LH T674 LS T676, LA T676, LO T676, LY T676, LB T676, LH T676, LSB T676, LW T676 LB T67C, LV T67C, LT T67C, LS T67K, LO T67K, LY T67K, LW E67C LS E67B, LA E67B, LO E67B, LY E67B, LB E67C, LV E67C, LT E67C LW T67C LS T679, LY T679, LG T679 LS T770, LO T770, LY T770, LG T770, LP T770 LB T773, LV T773, LT T773, LW T773 LH T774 LS E675, LA E675, LY E675, LS T675 LS T776, LA T776, LO T776, LY T776, LB T776 LHGB T686 LT T68C, LB T68C - Hyper Mini TOPLED® LB M676 - Mini TOPLED Santana® LG M470 LS M47K, LO M47K, LY M47K Source: http://www.osram.convergy.de LUXEON: - LUMILED® LXK2-PW12-R00, LXK2-PW12-S00, LXK2-PW14-U00, LXK2-PW14-V00 LXK2-PM12-R00, LXK2-PM12-S00, LXK2-PM14-U00 LXK2-PE12-Q00, LXK2-PE12-R00, LXK2-PE12-S00, LXK2-PE14-T00, LXK2-PE14-U00 LXK2-PB12-K00, LXK2-PB12-L00, LXK2-PB12-M00, LXK2-PB14-N00, LXK2-PB14-P00, LXK2-PB14-Q00 LXK2-PR12-L00, LXK2-PR12-M00, LXK2-PR14-Q00, LXK2-PR14-R00 LXK2-PD12-Q00, LXK2-PD12-R00, LXK2-PD12-S00 LXK2-PH12-R00, LXK2-PH12-S00 LXK2-PL12-P00, LXK2-PL12-Q00, LXK2-PL12-R00 Source: www.luxeon.com KINGBRIGHT: KA-3528ASYC Source: www.kingbright.com
LED113-LED224 = led:LED-2AC-: LEDs with 2 Cathode & 2 Anode - Kingbright SUPER FLUX LED LAMP Source: www.us.kingbright.com/images/catalog/SPEC/W7676CPBC-H.pdf
Q1 = crystal:CRYSTAL: CRYSTAL
R1-R23 = rcl:R-US_: RESISTOR, American symbol
S1-S4 = switch-omron:31-XX: OMRON SWITCH
X1-X4 = rbg-generic-headers:M08-100MIL
X5 = rbg-ftdi-usb:TTL-232R-5V
X6 = rbg-cui-dcpower:PJ-002